# EAGLE design MRFM12B (EAGLE 6.1)
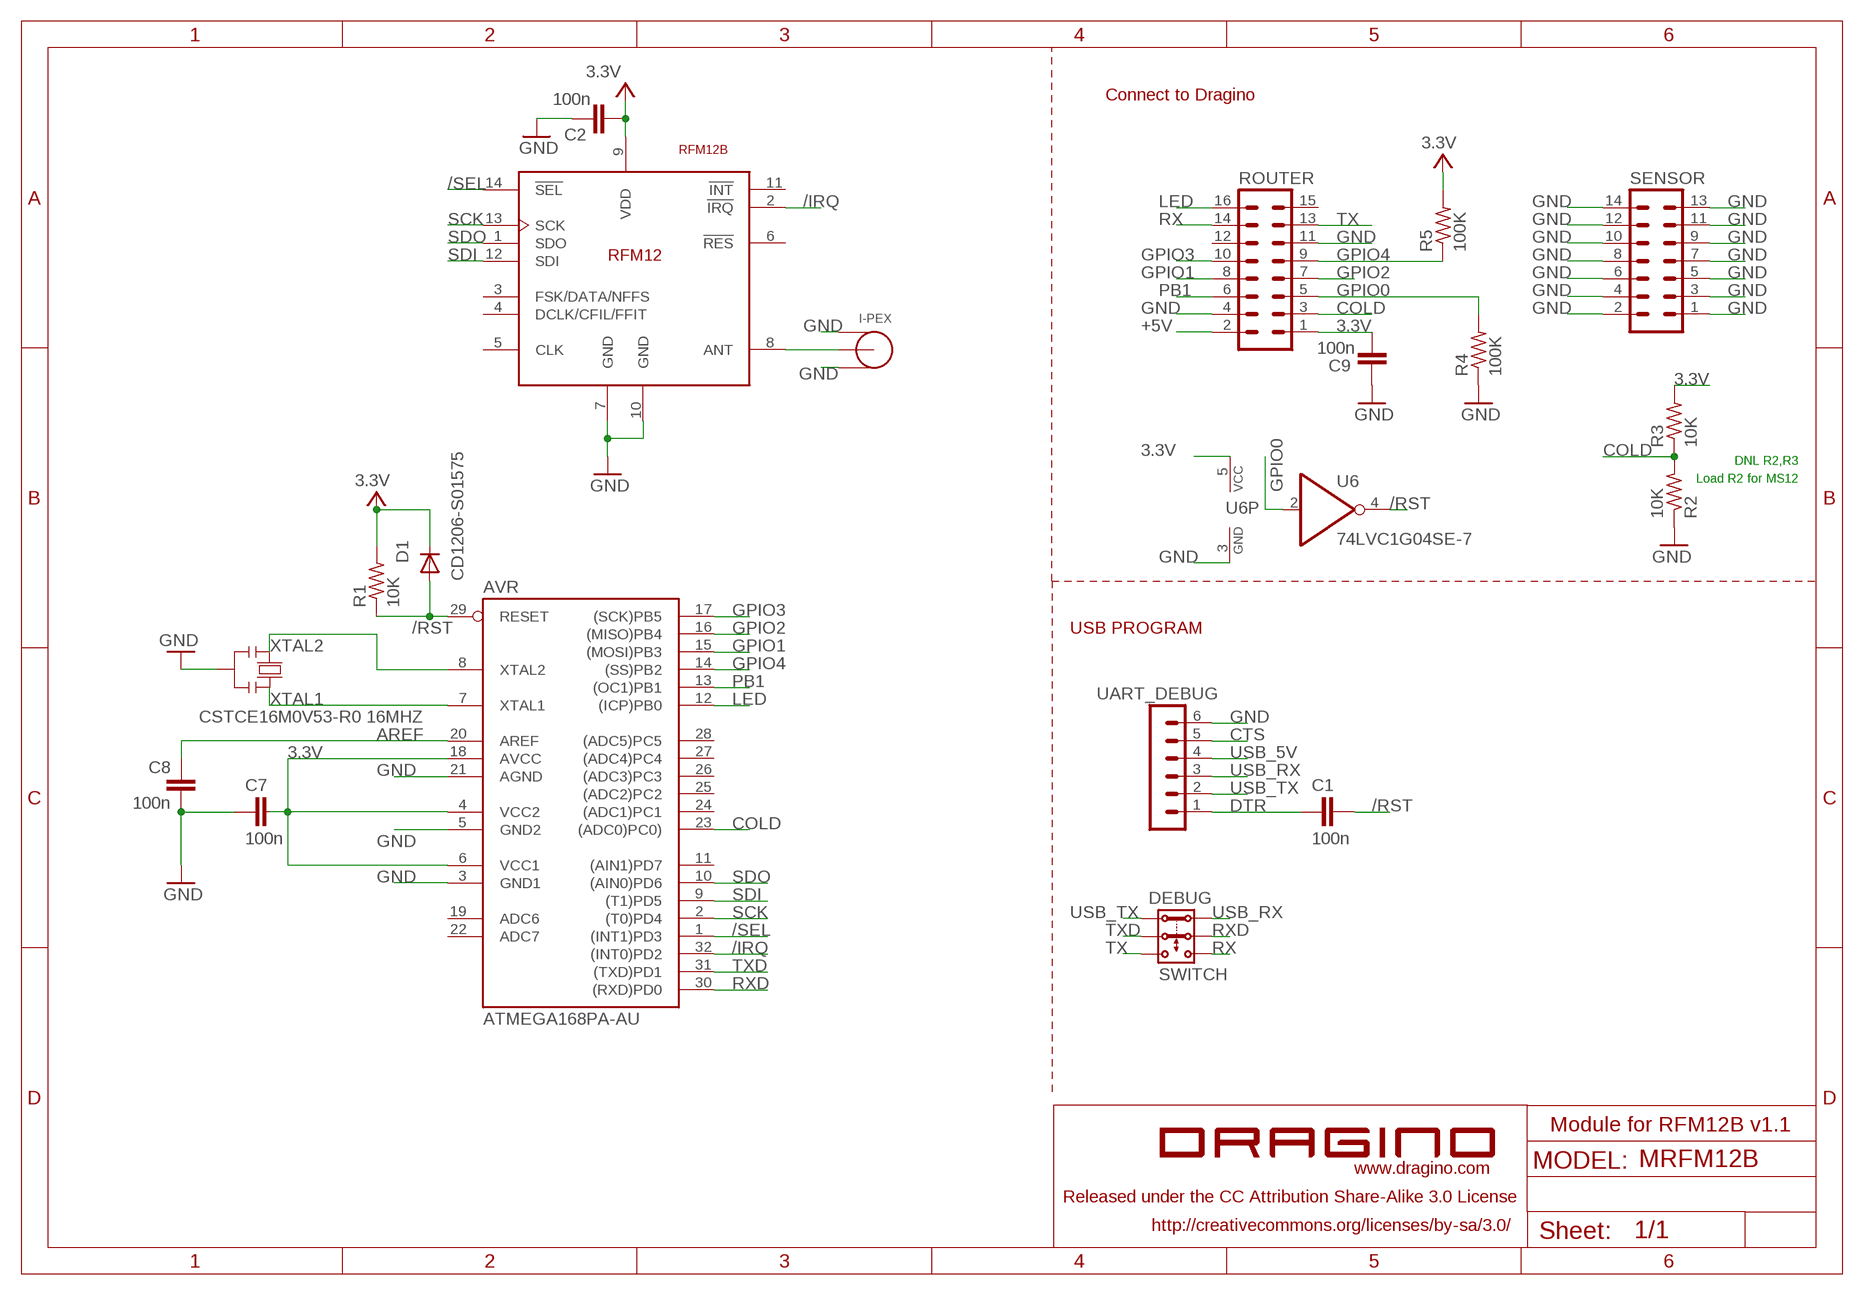
[diagram p0: schematic, sheet 1]

## Parts
AVR  ATMEGA168PA-AU  SMARTPRJ_ATMEGA328P-AU  [SMARTPRJ_TQFP32-08]
C1  100n  C-EUC0402  [C0402]
C2  100n  C-EUC0402  [C0402]
C7  100n  C-EUC0402  [C0402]
C8  100n  C-EUC0402  [C0402]
C9  100n  C-EUC0402  [C0402]
D1  CD1206-S01575  DIODE-MINIMELF  [MINIMELF]
DEBUG  SWITCH  SWITCH-2P2T  [2P2T]
I-PEX  I-PEX  [I-PEX]
R1  10K  R-US_R0402  [R0402]
R2  10K  R-US_R0402  [R0402]
R3  10K  R-US_R0402  [R0402]
R4  100K  R-US_R0402  [R0402]
R5  100K  R-US_R0402  [R0402]
RFM12B  RFM12B  RFM12_SMDSMD  [RFM12]
ROUTER  MA08-2  [MA08-2]
SENSOR  MA07-2  [MA07-2]
U6  74LVC1G04SE-7  74AHC1G04DCK  [SC70-5]
U$1  LOGO-SILK  [LOGO-SILK-15MM]
UART_DEBUG  MA06-1  [MA06-1]
Y1  CSTCE16M0V53-R0 16MHZ  RESONATORMU  [RESONATOR]

## Nets
3.3V: AVR.4(VCC2) AVR.6(VCC1) AVR.18(AVCC) C2.1 C7.1 C9.2 D1.C R1.2 R3.2 R5.2 RFM12B.9(VDD) ROUTER.1 U6.5(VCC)
+5V: ROUTER.2
/IRQ: AVR.32((INT0)PD2) RFM12B.2(!IRQ)
/RST: AVR.29(RESET) C1.1 D1.A R1.1 U6.4(O)
/SEL: AVR.1((INT1)PD3) RFM12B.14(!SEL)
AREF: AVR.20(AREF) C8.1
COLD: AVR.23((ADC0)PC0)) R2.2 R3.1 ROUTER.3
CTS: UART_DEBUG.5
DTR: C1.2 UART_DEBUG.1
GND [gnd]: AVR.3(GND1) AVR.5(GND2) AVR.21(AGND) C2.2 C7.2 C8.2 C9.1 I-PEX.GND I-PEX.GND1 R2.1 R4.1 RFM12B.7(GND) RFM12B.10(GND) ROUTER.4 ROUTER.11 SENSOR.1 SENSOR.2 SENSOR.3 SENSOR.4 SENSOR.5 SENSOR.6 SENSOR.7 SENSOR.8 SENSOR.9 SENSOR.10 SENSOR.11 SENSOR.12 SENSOR.13 SENSOR.14 U6.3(GND) UART_DEBUG.6 Y1.2
GPIO0: R4.2 ROUTER.5 U6.2(I)
GPIO1: AVR.15((MOSI)PB3) ROUTER.8
GPIO2: AVR.16((MISO)PB4) ROUTER.7
GPIO3: AVR.17((SCK)PB5) ROUTER.10
GPIO4: AVR.14((SS)PB2) R5.1 ROUTER.9
LED: AVR.12((ICP)PB0) ROUTER.16
N$1: I-PEX.SIG RFM12B.8(ANT)
PB1: AVR.13((OC1)PB1) ROUTER.6
RX: DEBUG.3.1 ROUTER.14
RXD: AVR.30((RXD)PD0) DEBUG.2.1
SCK: AVR.2((T0)PD4) RFM12B.13(SCK)
SDI: AVR.9((T1)PD5) RFM12B.12(SDI)
SDO: AVR.10((AIN0)PD6) RFM12B.1(SDO)
TX: DEBUG.3.2 ROUTER.13
TXD: AVR.31((TXD)PD1) DEBUG.2.2
USB_5V: UART_DEBUG.4
USB_RX: DEBUG.1.1 UART_DEBUG.3
USB_TX: DEBUG.1.2 UART_DEBUG.2
XTAL1: AVR.7(XTAL1) Y1.3
XTAL2: AVR.8(XTAL2) Y1.1
Unconnected: AVR.11((AIN1)PD7) AVR.19(ADC6) AVR.22(ADC7) AVR.24((ADC1)PC1) AVR.25((ADC2)PC2) AVR.26((ADC3)PC3) AVR.27((ADC4)PC4) AVR.28((ADC5)PC5) RFM12B.3(FSK/DATA/NFFS) RFM12B.4(DCLK/CFIL/FFIT) RFM12B.5(CLK) RFM12B.6(!RES) RFM12B.11(!INT) ROUTER.12 ROUTER.15

## Notes on the sheet
- Connect to Dragino
- DNL R2,R3
- Load R2 for MS12
- USB PROGRAM
- Module for RFM12B v1.1

## Library data of the parts
AVR = dragino:SMARTPRJ_ATMEGA328P-: MICROCONTROLLER 4 Kbytes FLASH 128 bytes SRAM 256 bytes EEPROM UART 6-channel 10 bit ADC
C1 C2 C7-C9 = SmartPrj:C-EU: CAPACITOR, European symbol
D1 = diode:DIODE-: DIODE
DEBUG = dragino:SWITCH-2P2T: SLIDE SWITCH 2P2T Part No. SS-22F05-G(A)4 Source: CANAL ELECTRONIC CO., LTD .. switsch.pdf
I-PEX = dragino:I-PEX: I-PEX connector
R1-R5 = dragino:R-US_: RESISTOR, American symbol
RFM12B = dragino:RFM12_SMD: RFM12 is a low costing ISM band transceiver module implemented with unique PLL. It works signal ranges from 315/433/868/915MHZ bands, comply with FCC, ETSI regulation. The SPI interface is used to communicate with microcontroller for parameter setting.
ROUTER = dragino:MA08-2: PIN HEADER; OC_FARNELL: unknown; OC_NEWARK: unknown
SENSOR = dragino:MA07-2: PIN HEADER; OC_FARNELL: unknown; OC_NEWARK: unknown
U6 = 74xx-little-de:74*1G04: INVERTER Gate
U$1 = dragino:LOGO-SILK: LOGO for Dragino
UART_DEBUG = dragino:MA06-1: PIN HEADER; OC_FARNELL: unknown; OC_NEWARK: unknown
Y1 = SmartPrj:RESONATOR

## Net classes
0 default: width 0.254 mm, clearance 0.254 mm
1 power: width 0.61 mm, drill 0.61 mm, clearance 0.254 mm
2 gnd: width 0.305 mm, drill 0.381 mm, clearance 0.254 mm
3 usbvcc: width 0.508 mm, drill 0.61 mm, clearance 0.254 mm
4 aref: width 0.406 mm, drill 0.61 mm, clearance 0.254 mm

## Board
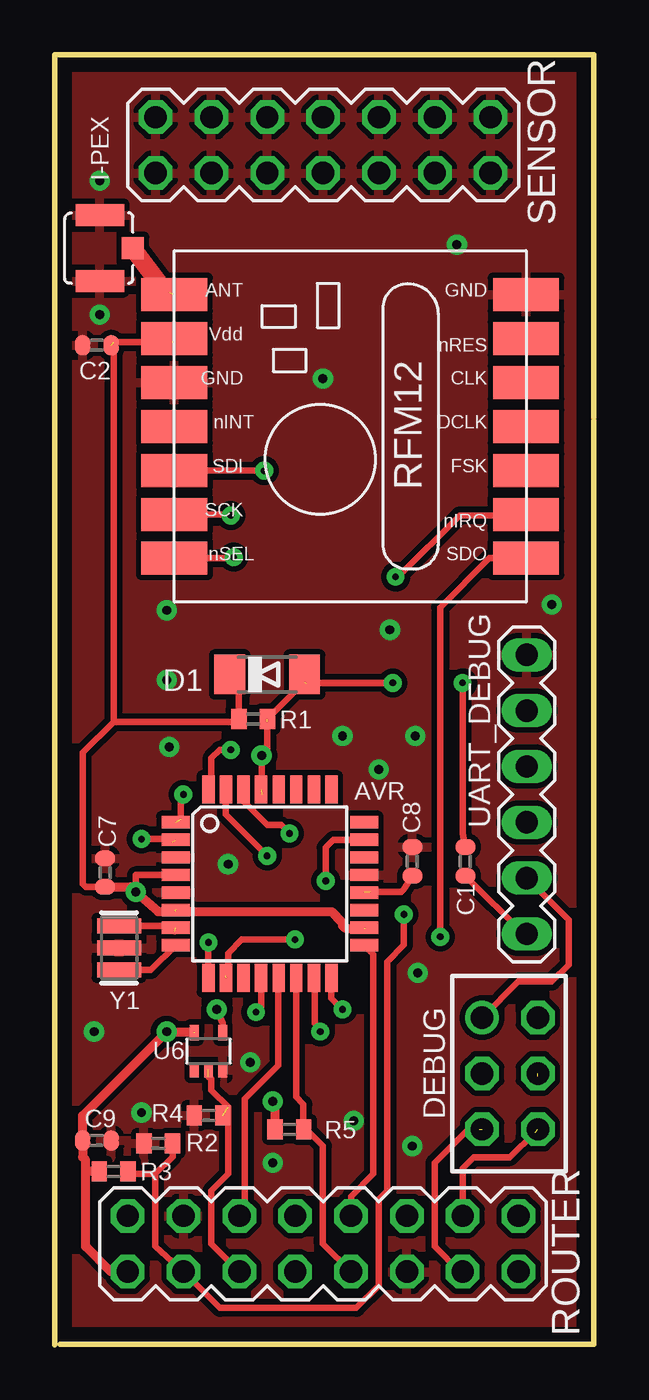
[diagram p1: board, top side]
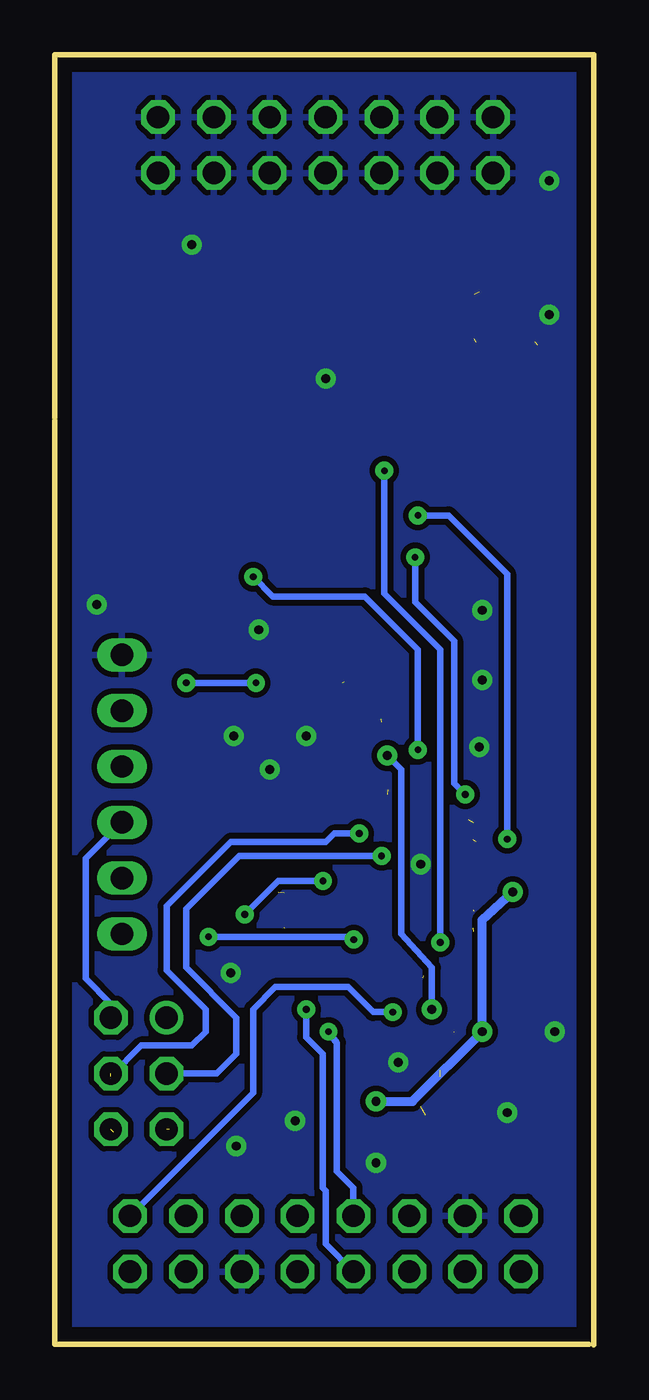
[diagram p2: board, bottom side, seen from below]

Size 24.51 x 58.69 mm. Coordinates in mm from the lower left corner, seen from the top.
Outline: 24.51,42.18 24.51,58.69 0,58.69 0,0
Outline: 24.51,42.05 24.51,0.02 0.24,0.02
Copper layers (1*16): Top 0.035mm / dielectric 1.5mm / Bottom 0.035mm
Design rules: minimum track width 5mil, minimum drill 10mil, track to track 8mil, track to pad 8mil, pad to pad 8mil, via to via 10mil, smd to smd 8mil, copper to edge 26mil, drill to drill 10mil, minimum pad ring 10mil, minimum via ring 10mil, stop-mask expansion 1mil, vias tented up to drill 30mil, thermal gap 10mil

### Footprints (pad centres in the part's own frame; a part is rotated, then mirrored left to right if it is on the bottom)
SMARTPRJ_TQFP32-08 = smd 1.27 x 0.559: 1 -4.293,2.8; 2 -4.293,2; 3 -4.293,1.2; 4 -4.293,0.4; 5 -4.293,-0.4; 6 -4.293,-1.2; 7 -4.293,-2; 8 -4.293,-2.8; 17 4.293,-2.8; 18 4.293,-2; 19 4.293,-1.2; 20 4.293,-0.4; 21 4.293,0.4; 22 4.293,1.2; 23 4.293,2; 24 4.293,2.8 | smd 0.559 x 1.27: 9 -2.8,-4.293; 10 -2,-4.293; 11 -1.2,-4.293; 12 -0.4,-4.293; 13 0.4,-4.293; 14 1.2,-4.293; 15 2,-4.293; 16 2.8,-4.293; 25 2.8,4.293; 26 2,4.293; 27 1.2,4.293; 28 0.4,4.293; 29 -0.4,4.293; 30 -1.2,4.293; 31 -2,4.293; 32 -2.8,4.293
C0402 = smd 0.7 x 0.9: 1 -0.65,0; 2 0.65,0
MINIMELF = smd 1.4 x 1.8: A 1.7,0; C -1.7,0
2P2T = drill 1.016 octagon: 1.1 -5.08,1.27; 2.1 -2.54,1.27; 2.2 -2.54,-1.27; 3.1 0,1.27; 3.2 0,-1.27 | drill 1.016: 1.2 -5.08,-1.27
I-PEX = smd 1 x 2.2: GND -1.65,-0.27; GND1 1.35,-0.27 | smd 1 x 1: SIG -0.15,-1.77
R0402 = smd 0.7 x 0.9: 1 -0.65,0; 2 0.65,0
RFM12 = smd 1.5 x 3: 1 -5,-10; 2 -3,-10; 3 -1,-10; 4 1,-10; 5 3,-10; 6 5,-10; 7 7,-10; 8 7,6; 9 5,6; 10 3,6; 11 1,6; 12 -1,6; 13 -3,6; 14 -5,6
MA08-2 = drill 1.016 octagon: 1 -8.89,-1.27; 2 -8.89,1.27; 3 -6.35,-1.27; 4 -6.35,1.27; 5 -3.81,-1.27; 6 -3.81,1.27; 7 -1.27,-1.27; 8 -1.27,1.27; 9 1.27,-1.27; 10 1.27,1.27; 11 3.81,-1.27; 12 3.81,1.27; 13 6.35,-1.27; 14 6.35,1.27; 15 8.89,-1.27; 16 8.89,1.27
MA07-2 = drill 1.016 octagon: 1 -7.62,-1.27; 2 -7.62,1.27; 3 -5.08,-1.27; 4 -5.08,1.27; 5 -2.54,-1.27; 6 -2.54,1.27; 7 0,-1.27; 8 0,1.27; 9 2.54,-1.27; 10 2.54,1.27; 11 5.08,-1.27; 12 5.08,1.27; 13 7.62,-1.27; 14 7.62,1.27
SC70-5 = smd 0.4 x 0.7: 1 -0.65,-0.85; 2 0,-0.85; 3 0.65,-0.85; 4 0.65,0.85; 5 -0.65,0.85
MA06-1 = drill 1.016 long: 1 -6.35,0; 2 -3.81,0; 3 -1.27,0; 4 1.27,0; 5 3.81,0; 6 6.35,0
RESONATOR = smd 0.7 x 2: 1 -1,0; 2 0,0; 3 1,0

### Placement (x,y rotation side)
AVR  9.78,20.97 0 top
C1  18.67,21.99 270 top
C2  1.9,45.48 180 top
C7  2.29,21.48 90 top
C8  16.26,21.99 90 top
C9  1.9,9.29 180 top
D1  9.65,30.5 0 top
DEBUG  20.7,9.79 270 top
I-PEX  1.78,50.05 90 top
R1  9.02,28.46 180 top
R2  4.7,9.16 0 top
R3  2.67,7.89 180 top
R4  6.98,10.43 0 top
R5  10.67,9.79 180 top
RFM12B  11.43,40.78 90 top
ROUTER  12.2,4.59 0 top
SENSOR  12.2,54.59 0 top
U6  6.98,13.35 0 top
U$1  2.03,29.48 90 top
UART_DEBUG  21.46,25.03 90 top
Y1  2.92,18.05 90 top

### Tracks (layer width: path | path; a pad name or v marks a point on that pad's centre or on a via)
3.3V  (via drill 0.41)  (5 unrouted)
  Top 0.305: 3.44,20.83 1.41,20.83 1.27,20.97 1.27,26.94 2.67,28.34 | 2.67,28.34 2.67,45.61 5.33,45.61 | 2.67,28.34 8.24,28.34 R1.2 8.37,30.08 D1.C | AVR.4 3.68,21.37 v3.68,20.59
  Top 0.406: ROUTER.1 2.54,3.32 1.4,4.46 1.4,7.89 | 1.4,7.89 1.4,8.4 1.25,8.54 C9.2 1.25,10.41 v5.08,14.24 6.35,14.24 | AVR.6 5.56,19.7 12.57,19.7 13.08,19.19 13.08,19.07 13.21,18.94 14.1,18.94 | 5.46,19.7 4.7,19.7 v3.68,20.59 3.44,20.83 C7.1 | R5.2 10.02,10.95 v9.91,11.06 | R3.2 1.4,7.89
  Bottom 0.406: v3.68,20.59 5.08,19.32 v5.08,14.24 8.25,11.06 v9.91,11.06
/IRQ  (via drill 0.3)
  Top 0.305: RFM12B.2 21.38,37.73 18.41,37.73 15.62,34.94 v15.49,34.94 | v8,27.07 7.49,27.07 7.11,26.69 7.11,25.4 AVR.32
  Bottom 0.305: v15.49,34.94 14.6,34.05 10.41,34.05 8,31.64 v8,27.07
/RST  (via drill 0.3, 0.41)  (3 unrouted)
  Top 0.305: AVR.29 9.4,25.28 | R1.1 11.35,30.15 D1.A | C1.1 18.54,23.26 v18.54,30.11 | v15.37,30.11 11.43,30.11 11.3,29.99 | U6.4 7.63,14.61 v7.37,15.26 | 9.52,24.91 9.4,25.03 v9.4,26.81 9.65,27.07 9.65,28.34
  Bottom 0.305: v18.54,30.11 v15.37,30.11 | v7.37,15.26 7.37,17.16 8.76,18.68 8.76,26.18 v9.4,26.81
/SEL  (via drill 0.3)  (1 unrouted)
  Top 0.305: RFM12B.14 8.08,35.78 v8.13,35.83 | v5.84,25.03 5.71,24.91 5.71,23.89
  Bottom 0.305: v8.13,35.83 8.13,33.8 6.35,32.02 6.35,25.54 v5.84,25.03
AREF  (1 unrouted)
  Top 0.305: C8.1 15.88,20.72 15.75,20.59 14.35,20.59
COLD  (via drill 0.3)
  Top 0.305: AVR.23 12.67,22.97 12.32,22.62 v12.32,21.1 | v15.88,19.57 15.88,18.18 15.11,17.41 15.11,7 14.73,6.62 14.73,2.68 13.72,1.67 7.5,1.67 ROUTER.3 4.57,4.46 4.57,7.76 | 4.57,7.76 5.35,8.54 R2.2 | R3.1 3.44,7.76 4.57,7.76
  Bottom 0.305: v12.32,21.1 14.35,21.1 v15.88,19.57
DTR
  Top 0.305: UART_DEBUG.1 21.32,18.68 C1.2
GND  (via drill 0.41)
  other vias: 1.78,14.24 5.08,33.42 5.21,27.19 5.08,30.24 8.89,12.84 13.59,10.18 9.91,8.27 16.26,9.03 16.51,16.91 13.08,27.7 16.38,27.7 14.73,26.18 12.19,43.96 18.29,50.05 7.87,21.86 2.03,46.88 3.94,10.56 15.24,32.53 22.61,33.67 2.03,52.97
  pour Top: 0,58.56 24.77,58.44 24.77,37.1 24.64,21.48 24.64,-0.75 0,-0.62
  pour Bottom: 0.25,58.82 0.25,-0.62 24.64,-0.62 24.89,16.14 24.51,42.31 24.77,58.82
GPIO0  (2 unrouted)
  Top 0.305: ROUTER.5 7.11,4.6 7.11,7 7.87,7.76 7.87,10.81 7.11,11.57 7.11,12.08 6.98,12.21
GPIO1  (via drill 0.3)
  Top 0.305: v12.06,14.24 12.06,14.37 11.81,14.62 11.81,16.65 AVR.15
  Bottom 0.305: ROUTER.8 10.93,7.14 11.68,7.89 11.68,13.73 v12.06,14.24
GPIO2  (via drill 0.3)
  Top 0.305: AVR.16 12.58,15.76 v13.08,15.26
  Bottom 0.305: v13.08,15.26 13.08,13.99 12.32,13.22 12.32,7.13 12.19,7 12.19,4.58 ROUTER.7
GPIO3
  Top 0.305: ROUTER.10 13.47,6.75 14.48,7.76 14.48,17.76 AVR.17
GPIO4
  Top 0.305: ROUTER.9 12.19,4.6 12.19,9.03 11.43,9.79 R5.1 11.3,9.81 11.3,10.94 10.98,11.26 AVR.14
LED  (via drill 0.3)
  Top 0.305: AVR.12 9.38,15.36 v9.14,15.13
  Bottom 0.305: v9.14,15.13 10.03,15.13 11.18,16.27 14.48,16.27 15.49,15.26 15.49,11.45 ROUTER.16
N$1  (1 unrouted)
  Top 0.61: 4.95,48.02 5.21,47.89
  Top 0.813: I-PEX.SIG 4.95,48.02
PB1
  Top 0.305: AVR.13 10.16,16.66 10.16,12.72 8.64,11.19 8.64,6.37 8.39,6.12 ROUTER.6
RX  (1 unrouted)
  Top 0.305: ROUTER.14 18.54,5.87 18.54,8.02 19.05,8.52 20.7,8.52 21.84,9.67
RXD  (via drill 0.3)  (1 unrouted)
  Top 0.305: AVR.30 8.58,24.71 9.65,23.64 10.29,23.64 v10.67,23.26
  Bottom 0.305: v10.67,23.26 11.81,23.26 12.19,22.88 16.51,22.88 19.43,19.95 19.43,17.03 17.65,15.26 17.65,14.24 18.29,13.6 20.57,13.6 21.97,12.21
SCK  (via drill 0.3)  (1 unrouted)
  Top 0.305: RFM12B.13 7.95,37.78 v8,37.73 | v3.94,23 5.21,23 5.33,22.88
  Bottom 0.305: v8,37.73 6.6,37.73 3.94,35.07 v3.94,23
SDI  (via drill 0.3)
  Top 0.305: v6.98,18.3 AVR.9 | RFM12B.12 9.51,39.78 v9.52,39.77
  Bottom 0.305: v6.98,18.3 6.98,31.64 9.52,34.18 v9.52,39.77
SDO  (via drill 0.3)  (1 unrouted)
  Top 0.305: RFM12B.1 19.77,35.78 17.53,33.54 v17.53,18.56 | v10.92,18.43 8.51,18.43 7.87,17.8 7.87,16.91 7.75,16.78
  Bottom 0.305: v17.53,18.56 11.05,18.56 v10.92,18.43
TX  (1 unrouted)
  Top 0.305: ROUTER.13 18.41,3.32 17.27,4.46 17.27,8.27 18.8,9.79 19.3,9.79
TXD  (via drill 0.3)
  Top 0.305: AVR.31 7.78,24.11 v9.65,22.24
  Bottom 0.305: v9.65,22.24 16.13,22.24 18.54,19.83 18.54,17.16 16.26,14.87 16.26,13.22 17.14,12.33 DEBUG.2.2
USB_RX
  Bottom 0.305: DEBUG.1.1 21.97,15.51 23.11,16.65 23.11,22.11 UART_DEBUG.3
USB_TX
  Top 0.305: DEBUG.1.2 21.08,16.53 22.61,16.53 23.37,17.29 23.37,19.32 UART_DEBUG.2
XTAL1  (1 unrouted)
  Top 0.305: Y1.3 5.22,19.05 5.46,18.81
XTAL2
  Top 0.305: Y1.1 4.36,17.05 AVR.8

### Text on the board
bNames: designed by | MADE IN | tinker it | ITALY | ATMEGA328
tDocu: GND | N/A | N/A | RX | TX | DTR | ON | Wireless Module: MRFM12B V1.1
214bmp: D:/SmartProjects/Snc/a4_bn_logo2.bmp